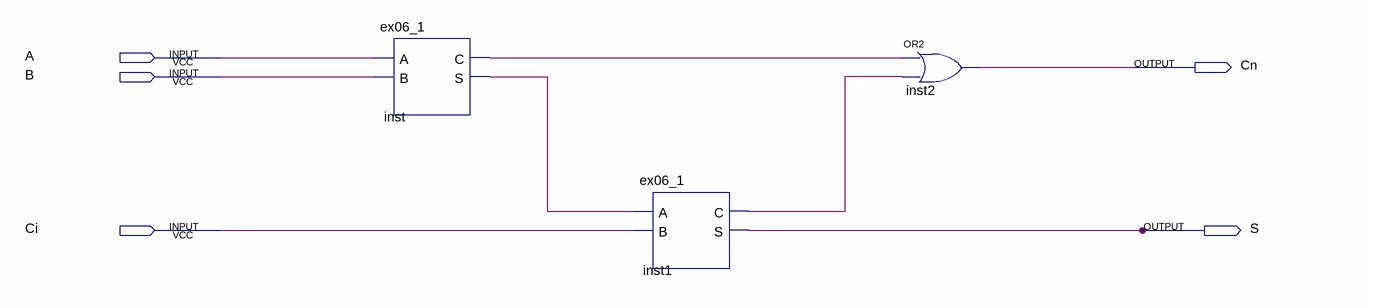
[diagram p0: schematic sheet]
// Quartus schematic fa2.bdf as structural Verilog: 3 symbols, 5 pins
module fa2 (
  input  A,
  input  B,
  input  Ci,
  output Cn,
  output S
);

  wire inst1_c, inst_c, inst_s;

  ex06_1 inst (.A(A), .B(B), .C(inst_c), .S(inst_s));
  ex06_1 inst1 (.A(inst_s), .B(Ci), .C(inst1_c), .S(S));
  or inst2 (Cn, inst_c, inst1_c);
endmodule
